# Altium schematic sheet Main.SchDoc
size A3
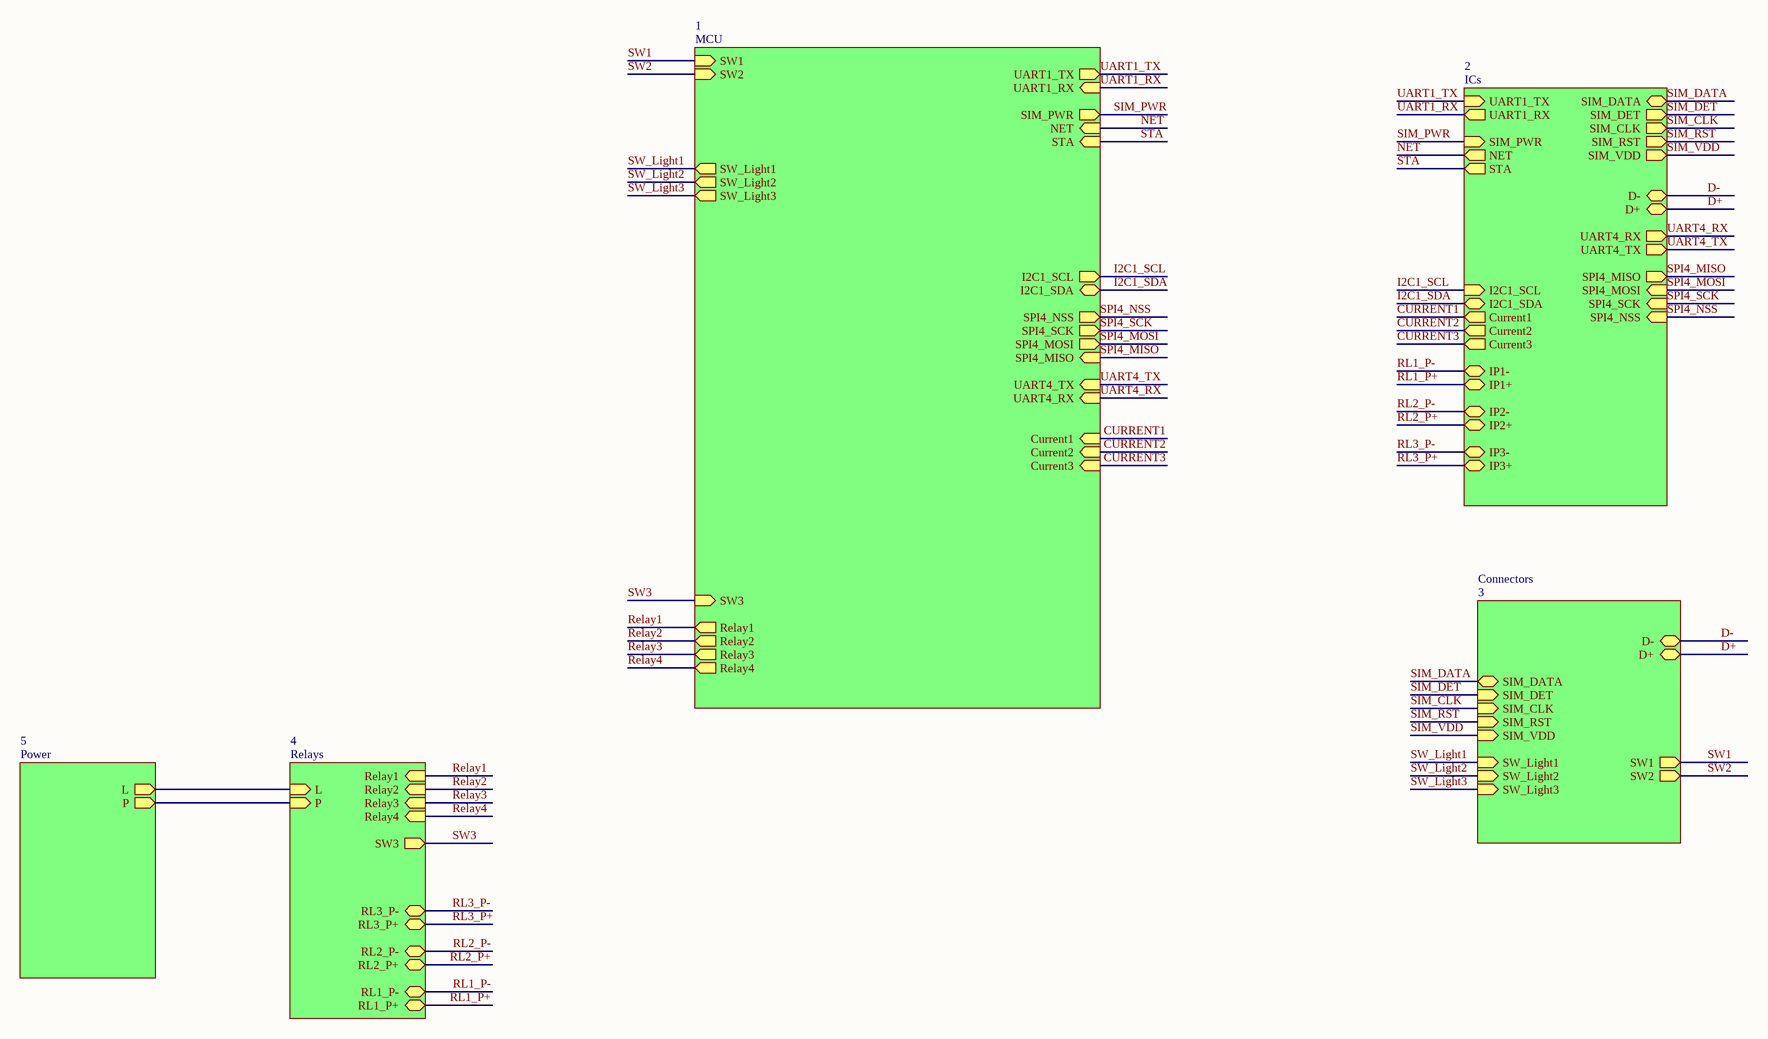
[diagram p0: Main.SchDoc]

## Sub-sheets
1 = MCU: Relay1 (out), Relay2 (out), UART4_RX (in), UART1_TX (out), UART1_RX (in), SIM_PWR (out), NET (in), STA (in), I2C1_SCL (out), I2C1_SDA (bidir), SPI4_NSS (out), SPI4_SCK (out), SPI4_MOSI (out), SPI4_MISO (in), SW1 (in), SW2 (in), SW_Light1 (out), SW_Light2 (out), Current1 (in), Current2 (in), SW_Light3 (out), UART4_TX (in), Relay3 (out), Relay4 (out), SW3 (in), Current3 (in)
2 = ICs: STA (out), NET (out), SIM_PWR (in), UART1_RX (out), UART1_TX (in), I2C1_SCL (in), I2C1_SDA (bidir), SPI4_NSS (in), SPI4_SCK (in), SPI4_MOSI (in), SPI4_MISO (out), UART4_RX (out), D+ (bidir), D- (bidir), SIM_CLK (out), SIM_DATA (bidir), SIM_DET (out), SIM_RST (out), SIM_VDD (out), IP2- (bidir), IP2+ (bidir), IP1- (bidir), IP1+ (bidir), Current1 (out), Current2 (out), UART4_TX (out), IP3- (bidir), IP3+ (bidir), Current3 (out)
3 = Connectors: SW_Light1 (in), SW_Light2 (in), D- (bidir), D+ (bidir), SW1 (out), SW2 (out), SIM_DATA (bidir), SIM_DET (in), SIM_CLK (in), SIM_RST (in), SIM_VDD (in), SW_Light3 (in)
4 = Relays: Relay1 (in), Relay2 (in), L (in), P (in), RL1_P- (bidir), RL1_P+ (bidir), RL2_P- (bidir), RL2_P+ (bidir), Relay3 (in), RL3_P+ (bidir), Relay4 (in), RL3_P- (bidir), SW3 (out)
5 = Power: L (out), P (out)

## Nets
CURRENT1: sheet 1/Current1, sheet 2/Current1
CURRENT2: sheet 1/Current2, sheet 2/Current2
CURRENT3: sheet 1/Current3, sheet 2/Current3
D+: sheet 3/D+, sheet 2/D+
D-: sheet 3/D-, sheet 2/D-
I2C1_SCL: sheet 1/I2C1_SCL, sheet 2/I2C1_SCL
I2C1_SDA: sheet 1/I2C1_SDA, sheet 2/I2C1_SDA
NET: sheet 1/NET, sheet 2/NET
Relay1: sheet 1/Relay1, sheet 4/Relay1
Relay2: sheet 1/Relay2, sheet 4/Relay2
Relay3: sheet 1/Relay3, sheet 4/Relay3
Relay4: sheet 1/Relay4, sheet 4/Relay4
RL1_P+: sheet 4/RL1_P+, sheet 2/IP1+
RL1_P-: sheet 4/RL1_P-, sheet 2/IP1-
RL2_P+: sheet 4/RL2_P+, sheet 2/IP2+
RL2_P-: sheet 4/RL2_P-, sheet 2/IP2-
RL3_P+: sheet 4/RL3_P+, sheet 2/IP3+
RL3_P-: sheet 4/RL3_P-, sheet 2/IP3-
SIM_CLK: sheet 3/SIM_CLK, sheet 2/SIM_CLK
SIM_DATA: sheet 3/SIM_DATA, sheet 2/SIM_DATA
SIM_DET: sheet 3/SIM_DET, sheet 2/SIM_DET
SIM_PWR: sheet 1/SIM_PWR, sheet 2/SIM_PWR
SIM_RST: sheet 3/SIM_RST, sheet 2/SIM_RST
SIM_VDD: sheet 3/SIM_VDD, sheet 2/SIM_VDD
SPI4_MISO: sheet 1/SPI4_MISO, sheet 2/SPI4_MISO
SPI4_MOSI: sheet 1/SPI4_MOSI, sheet 2/SPI4_MOSI
SPI4_NSS: sheet 1/SPI4_NSS, sheet 2/SPI4_NSS
SPI4_SCK: sheet 1/SPI4_SCK, sheet 2/SPI4_SCK
STA: sheet 1/STA, sheet 2/STA
SW1: sheet 1/SW1, sheet 3/SW1
SW2: sheet 1/SW2, sheet 3/SW2
SW3: sheet 1/SW3, sheet 4/SW3
SW_Light1: sheet 1/SW_Light1, sheet 3/SW_Light1
SW_Light2: sheet 1/SW_Light2, sheet 3/SW_Light2
SW_Light3: sheet 1/SW_Light3, sheet 3/SW_Light3
UART1_RX: sheet 1/UART1_RX, sheet 2/UART1_RX
UART1_TX: sheet 1/UART1_TX, sheet 2/UART1_TX
UART4_RX: sheet 1/UART4_RX, sheet 2/UART4_RX
UART4_TX: sheet 1/UART4_TX, sheet 2/UART4_TX
(unnamed): sheet 4/L, sheet 5/L
(unnamed): sheet 4/P, sheet 5/P